# EAGLE board Lattepanda_shild_v1.2 (EAGLE 6.5.0)
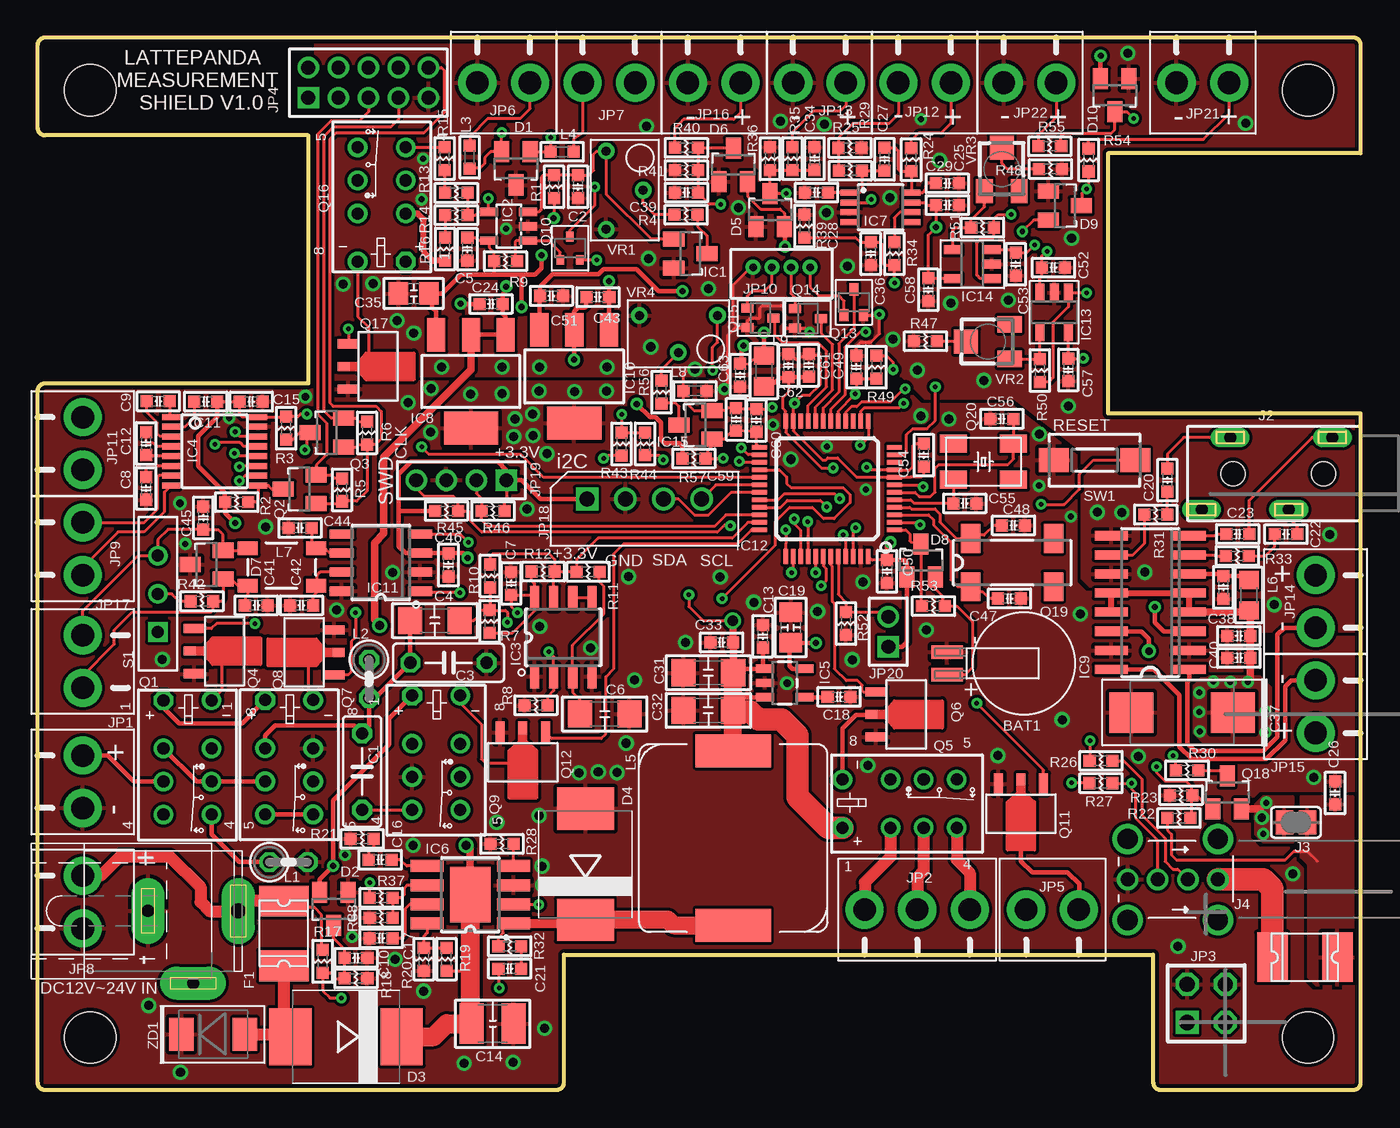
[diagram p1: board, top side]
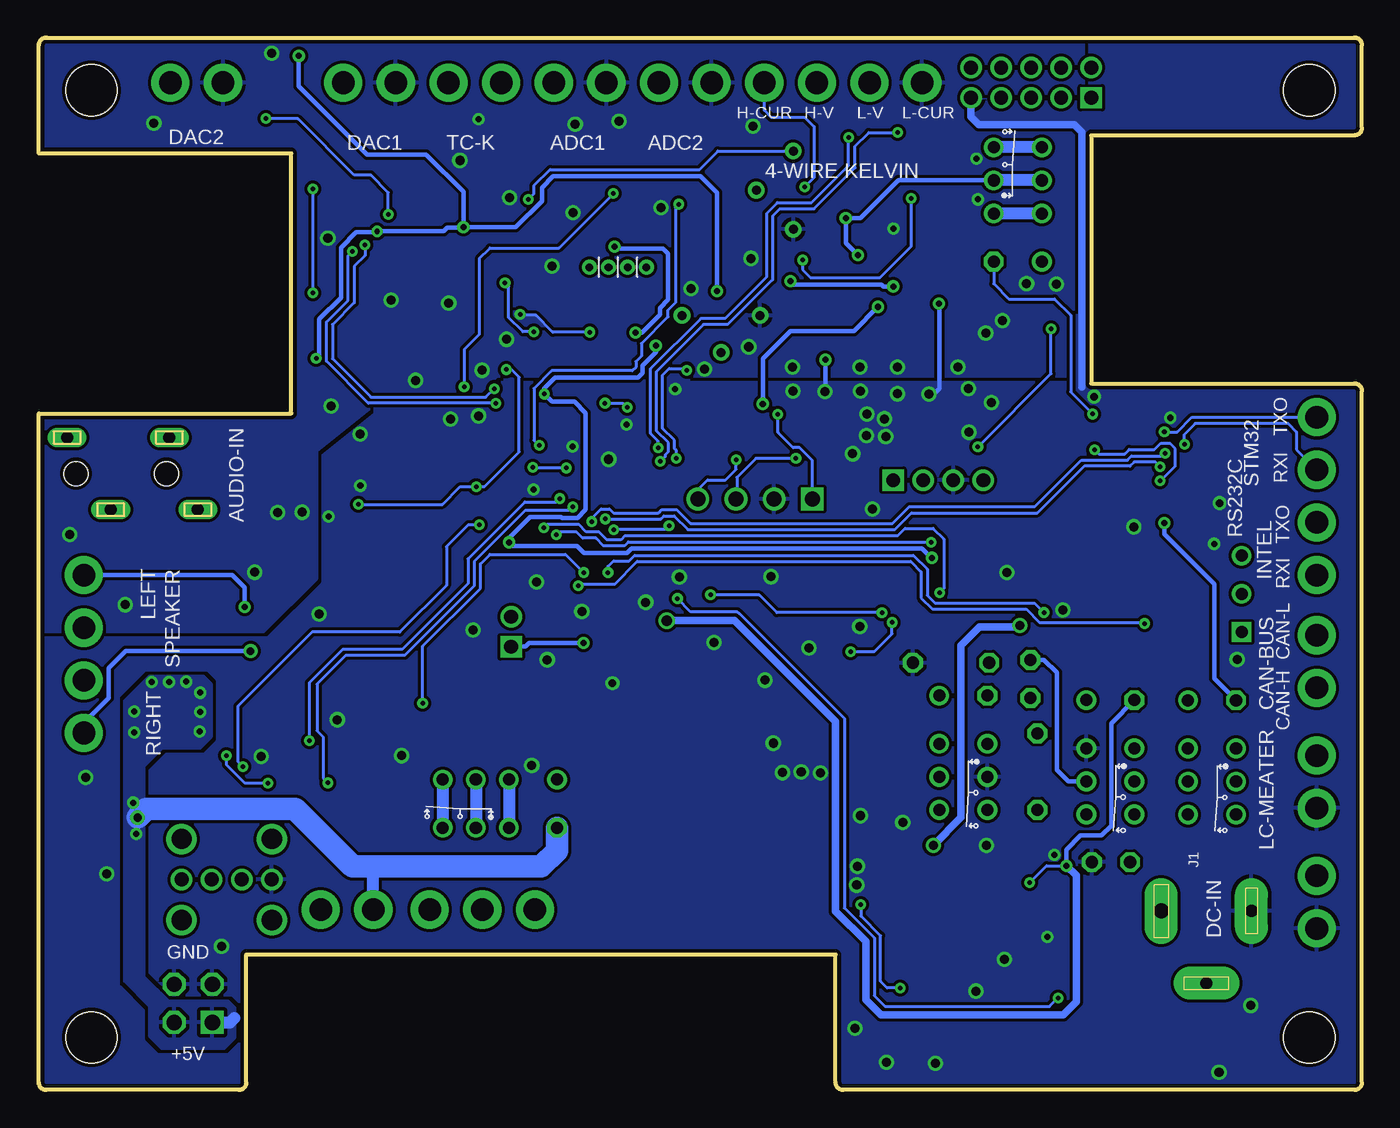
[diagram p2: board, bottom side, seen from below]

Size 88 x 70 mm. Coordinates in mm from the lower left corner, seen from the top.
Outline: 87.5,70 0.5,70 arc90 0,69.5 0,64 arc90 0.5,63.5 18,63.5 18,47 0.5,47 arc90 0,46.5 0,0.5 arc90 0.5,0 34.5,0 arc90 35,0.5 35,9 74.2,9 74.2,0.5 arc90 74.7,0 87.5,0 arc90 88,0.5 88,45 71.2,45 71.2,62.3 88,62.3 88,69.5 arc90 87.5,70
Copper layers (1*16): Top 0.035mm / dielectric 1.5mm / Bottom 0.035mm
Design rules "KHC_mm": minimum track width 0.2mm, minimum drill 0.3mm, track to track 0.2mm, track to pad 0.2mm, pad to pad 0.2mm, via to via 0.2mm, smd to smd 0.2mm, copper to edge 10mil, drill to drill 0.2mm, minimum pad ring 10mil, minimum via ring 8mil, stop-mask expansion 4mil, vias tented up to drill 0mil, thermal gap 10mil
Net classes: 0 default: clearance 0.2 mm; 1 power: width 0.152 mm; 2 GND: width 0.152 mm, clearance 0.152 mm
Holes 3.4 mm at 3.5,66.5 84.5,66.5 3.5,3.5 84.5,3.5

## Footprints (pad centres in the part's own frame; a part is rotated, then mirrored left to right if it is on the bottom)
MS621 = smd 2.1 x 0.9: + 5.1,0.75; - 5.1,-0.75
C050-025X075 = drill 0.813 octagon: 1 -2.54,0; 2 2.54,0
C0603 = smd 0.8 x 0.8: 1 -0.762,0; 2 0.762,0
C3216 = smd 1.6 x 1.8: 1 -1.651,0; 2 1.651,0
C3225 = smd 1.6 x 2.7: 1 -1.397,0; 2 1.397,0
C2012 = smd 1.3 x 1.5: 1 -1.016,0; 2 1.016,0
C1608- = smd 0.8 x 0.8: 1 -0.762,0; 2 0.762,0
D/7343-31W = smd 2.95 x 2.7: + 3.375,0; - -3.375,0
SOT23 = smd 1 x 1.4: D 0,-1.1; G 0.95,1.1; S -0.95,1.1
SMC = smd 2.8 x 3.8: A 3.7,0; C -3.7,0
1812L = smd 2.03 x 3.3: P$1 -2.16,0; P$2 2.16,0
SOT23-5L = smd 0.55 x 1.2: 1 -0.95,-1.3; 2 0,-1.3; 3 0.95,-1.3; 4 0.95,1.3; 5 -0.95,1.3
SO8 = smd 0.6 x 1.6: 1 -1.905,-2.6; 2 -0.635,-2.6; 3 0.635,-2.6; 4 1.905,-2.6; 5 1.905,2.6; 6 0.635,2.6; 7 -0.635,2.6; 8 -1.905,2.6
PW_R-PDSO-G16 = smd 0.4 x 1.2: 1 -2.275,-2.9; 2 -1.625,-2.9; 3 -0.975,-2.9; 4 -0.325,-2.9; 5 0.325,-2.9; 6 0.975,-2.9; 7 1.625,-2.9; 8 2.275,-2.9; 9 2.275,2.9; 10 1.625,2.9; 11 0.975,2.9; 12 0.325,2.9; 13 -0.325,2.9; 14 -0.975,2.9; 15 -1.625,2.9; 16 -2.275,2.9
SOT23-5 = smd 0.55 x 1.2: 1 -0.95,-1.3; 2 0,-1.3; 3 0.95,-1.3; 4 0.95,1.3; 5 -0.95,1.3
S08-EP1 = smd 0.8 x 2.2: 1 -1.905,-2.87; 2 -0.635,-2.87; 3 0.635,-2.87; 4 1.905,-2.87; 5 1.905,2.87; 6 0.635,2.87; 7 -0.635,2.87; 8 -1.905,2.87 | smd 3.7 x 2.71: EX_PAD 0,0
MSOP8 = smd 0.4 x 1.2: 1 -0.975,-2.05; 2 -0.325,-2.05; 3 0.325,-2.05; 4 0.975,-2.05; 5 0.975,2.05; 6 0.325,2.05; 7 -0.325,2.05; 8 -0.975,2.05
SOT223-4 = smd 1.2 x 2.2: 1 -2.311,-3.1; 2 0,-3.1; 3 2.311,-3.1 | smd 3.6 x 2.2: 4 0,3.1
SOIC16N = smd 0.6 x 2.2: 1 -4.445,-2.6; 2 -3.175,-2.6; 3 -1.905,-2.6; 4 -0.635,-2.6; 5 0.635,-2.6; 6 1.905,-2.6; 7 3.175,-2.6; 8 4.445,-2.6; 9 4.445,2.6; 10 3.175,2.6; 11 1.905,2.6; 12 0.635,2.6; 13 -0.635,2.6; 14 -1.905,2.6; 15 -3.175,2.6; 16 -4.445,2.6
SOT223 = smd 1.219 x 2.235: 1 -2.311,-3.099; 2 0,-3.099; 3 2.311,-3.099 | smd 3.6 x 2.2: 4 0,3.099
TQFP48 = smd 0.3 x 1: 1 -2.75,-4.5; 2 -2.25,-4.5; 3 -1.75,-4.5; 4 -1.25,-4.5; 5 -0.75,-4.5; 6 -0.25,-4.5; 7 0.25,-4.5; 8 0.75,-4.5; 9 1.25,-4.5; 10 1.75,-4.5; 11 2.25,-4.5; 12 2.75,-4.5; 25 2.75,4.5; 26 2.25,4.5; 27 1.75,4.5; 28 1.25,4.5; 29 0.75,4.5; 30 0.25,4.5; 31 -0.25,4.5; 32 -0.75,4.5; 33 -1.25,4.5; 34 -1.75,4.5; 35 -2.25,4.5; 36 -2.75,4.5 | smd 1 x 0.3: 13 4.5,-2.75; 14 4.5,-2.25; 15 4.5,-1.75; 16 4.5,-1.25; 17 4.5,-0.75; 18 4.5,-0.25; 19 4.5,0.25; 20 4.5,0.75; 21 4.5,1.25; 22 4.5,1.75; 23 4.5,2.25; 24 4.5,2.75; 37 -4.5,2.75; 38 -4.5,2.25; 39 -4.5,1.75; 40 -4.5,1.25; 41 -4.5,0.75; 42 -4.5,0.25; 43 -4.5,-0.25; 44 -4.5,-0.75; 45 -4.5,-1.25; 46 -4.5,-1.75; 47 -4.5,-2.25; 48 -4.5,-2.75
SOT23-5' = smd 0.6 x 1.2: 1 -0.95,-1.306; 2 0,-1.306; 3 0.95,-1.306; 4 0.95,1.306; 5 -0.95,1.306
SPC4077 = drill 0.8 pad 2.184 long: 1 -3,0; 2 0,-4.8 | drill 1 pad 2.184 long: 3 3,0
PJ-327-2 = drill 0.8 long: 1 -2.4,-1.9; 2 2.4,-4.8; 3 -2.4,-8.7; 4 2.4,-10.6 | hole 1.6: 0,-2.5; 0,-8.5
SJ = smd 1.168 x 1.6: 1 -0.762,0; 2 0.762,0
USB_AF_SIDE = drill 0.92: 1 3,0; 2 1,0; 3 -1,0; 4 -3,0 | drill 1.35: SH1 -3,2.7; SH2 3,2.7; SH3 -3,-2.7; SH4 3,-2.7
ED350V-02P = drill 1.5 pad 2.54: 1 -1.75,0; 2 1.75,0
ED350V-03P = drill 1.5 pad 2.54: 1 -3.5,0; 2 0,0; 3 3.5,0
2X02 = drill 1.016 square: 1 -1.27,-1.27 | drill 1.016 octagon: 2 -1.27,1.27; 3 1.27,-1.27; 4 1.27,1.27
2X05M = drill 0.914 square: 1 -4,-1 | drill 0.914: 2 -4,1; 3 -2,-1; 4 -2,1; 5 0,-1; 6 0,1; 7 2,-1; 8 2,1; 9 4,-1; 10 4,1
53047-04 = drill 0.5 pad 0.95: 1 -1.895,0; 2 -0.645,0; 3 0.625,0; 4 1.895,0
MOLEX5267-04 = drill 1 square: 1 -3.81,0 | drill 1: 2 -1.27,0; 3 1.27,0; 4 3.81,0
1X04M = drill 0.914 square: 1 -3,0 | drill 0.914: 2 -1,0; 3 1,0; 4 3,0
1X02M = drill 0.914 square: 1 -1,0 | drill 0.914: 2 1,0
0207/2V = drill 0.813 octagon: 1 -1.27,0; 2 1.27,0
L0603 = smd 0.8 x 0.8: 1 -0.762,0; 2 0.762,0
SHP1260P-F = smd 2.2 x 5: 1 -5.8,0; 2 5.8,0
L0805 = smd 1.2 x 1.3: 1 -1.016,0; 2 1.016,0
ACT45B = smd 1.35 x 0.9: 1 -2.275,1.25; 2 -2.275,-1.25; 3 2.275,-1.25; 4 2.275,1.25
ANG200X = drill 0.8 octagon: 1 -4.3,-1.6 | drill 0.8: 2 -1.1,-1.6; 3 1.1,-1.6; 4 3.3,-1.6; 5 3.3,1.6; 6 1.1,1.6; 7 -1.1,1.6; 8 -4.3,1.6
MPT3 = smd 0.6 x 1.4: BASE -1.5,-2; EMITTER 1.5,-2 | smd 0.6 x 0.8: COLLECTOR 0,-2.3
SOT323 = smd 0.5 x 0.65: 1 0.65,-0.775; 2 -0.65,-0.775; 3 0,0.775
SC59-BEC = smd 0.6 x 0.8: 1 0.65,-0.863; 2 -0.65,-0.863; 3 0,0.863
MC-306 = smd 1.3 x 1.9: 1 -2.75,-1.6; 2 2.75,-1.6; 3 2.75,1.6; 4 -2.75,1.6
SMD5032 = smd 1.8 x 1.2: 1 -2,-1.2; 2 2,-1.2; 3 2,1.2; 4 -2,1.2
R0603 = smd 0.8 x 0.8: 1 -0.762,0; 2 0.762,0
R0603@1 = smd 0.8 x 0.8: 1 -0.762,0; 2 0.762,0
255SB = drill 0.8 square: 1 -2.54,0 | drill 0.8: 2 0,0; 3 2.54,0
DTSM-3 = smd 2 x 1.6: 1 -2.7,0; 2 2.7,0
3266W = drill 0.6: 1 -2.6,-1.23; 2 0,1.23; 3 2.6,-1.23
R-TRIMMER-3313J = smd 1.1 x 1.6: 1 -1.15,-1.45; 3 1.15,-1.45 | smd 1.6 x 1.6: 2 0,1.45
SMB = smd 1.62 x 2.18: A 2.11,0; C -2.11,0

## Placement (x,y rotation side)
BAT1  MS621  [MS621]  65.59,28.37 180 top
C1  1000pF/1%  [C050-025X075]  21.58,21.18 270 top
C2  0.1uF  [C0603]  35.94,60.08 90 top
C3  1000pF/1%  [C050-025X075]  27.33,28.42 0 top
C4  10uF/16V  [C3216]  26.42,31.22 180 top
C5  0.1uF  [C0603]  28.58,55.92 270 top
C6  10uF/16V  [C3216]  37.72,25.01 0 top
C7  0.1uF  [C0603]  31.5,33.7 90 top
C8  0.1uF  [C0603]  7.22,40.02 90 top
C9  0.1uF  [C0603]  8.03,45.81 0 top
C10  10nF  [C0603]  21.17,8.78 0 top
C11  0.1uF  [C0603]  11.19,45.79 180 top
C12  0.1uF  [C0603]  7.22,43.01 90 top
C13  1uF/10V  [C0603]  48.23,30.18 270 top
C14  10uF/35V  [C3225]  30.27,4.41 0 top
C15  0.1uF  [C0603]  14.21,45.79 180 top
C16  2.2nF/50V  [C0603]  22.79,15.32 180 top
C17  0.1uF/50V  [C0603]  22.86,10.1 180 top
C18  470pF  [C0603]  53.31,26.15 180 top
C19  4.7uF  [C2012]  50.09,30.76 90 top
C20  0.22uF  [C0603]  75.14,40.57 90 top
C21  10nF/50V  [C0603]  31.41,8.07 180 top
C22  0.22uF  [C0603]  83.03,36.97 0 top
C23  1uF  [C0603]  79.82,36.98 0 top
C24  0.1uF/50V  [C1608-]  30.15,52.28 0 top
C25  10nF  [C0603]  60.5,60.31 0 top
C26  0.1uF  [C0603]  86.29,19.76 90 top
C27  0.1uF  [C0603]  56.33,61.9 270 top
C28  10nF  [C0603]  51.81,59.69 180 top
C29  10nF  [C0603]  60.51,58.86 0 top
C30  1uF  [C0603]  78.86,33.43 270 top
C31  22uF/10V  [C3216]  44.62,27.75 180 top
C32  22uF/10V  [C3216]  44.61,25.25 180 top
C33  0.1uF  [C0603]  45.5,29.77 180 top
C34  10nF  [C0603]  51.68,61.96 90 top
C35  4.7uF  [C2012]  25.01,52.98 180 top
C36  1uF  [C0603]  55.41,55.62 270 top
C37  470uF  [D/7343-31W]  76.12,25.11 0 top
C38  1uF  [C0603]  79.89,30.2 0 top
C39  10nF  [C0603]  43.15,59.69 180 top
C40  0.1uF  [C0603]  79.89,28.74 0 top
C41  47pF  [C0603]  14.55,32.24 0 top
C42  47pF  [C0603]  17.55,32.24 180 top
C43  0.1uF/50V  [C0603]  37.26,52.74 180 top
C44  47pF  [C0603]  17.45,37.39 180 top
C45  47pF  [C0603]  11.02,38.05 270 top
C46  0.1uF  [C0603]  27.32,34.92 90 top
C47  12.5pF  [C0603]  64.64,32.69 180 top
C48  12.5pF  [C0603]  64.9,37.55 180 top
C49  0.1uF  [C0603]  54.45,48.09 90 top
C50  1uF  [C0603]  56.5,34.49 270 top
C51  1uF/16V  [C0603]  34.18,52.82 180 top
C52  10nF  [C0603]  67.56,54.7 180 top
C53  10nF  [C0603]  65.06,54.93 90 top
C54  1uF  [C0603]  58.94,42.23 90 top
C55  18pF  [C0603]  61.67,39.02 180 top
C56  18pF  [C0603]  64.13,44.64 0 top
C57  100nF  [C0603]  68.55,47.9 90 top
C58  100nF  [C0603]  59.24,53.23 90 top
C59  1uF  [C0603]  46.46,44.61 90 top
C60  10nF  [C0603]  47.8,44.54 270 top
C61  1uF  [C0603]  51.29,48.2 270 top
C62  10nF  [C0603]  49.93,48.18 270 top
C63  1uF  [C0603]  46.72,47.54 90 top
D1  NPU2105  [SOT23]  31.82,61.3 0 top
D2  BAV99  [SOT23]  19.7,12.05 0 top
D3  MBRS540T3  [SMC]  20.52,3.54 180 top
D4  MBRS540T3  [SMC]  36.44,15.02 90 top
D5  BAV99  [SOT23]  48.72,58.53 180 top
D6  BAV99  [SOT23]  46.27,61.53 180 top
D7  NPU2105  [SOT23]  11.24,34.95 270 top
D8  BAT54C  [SOT23]  58.76,35.22 180 top
D9  BAV99  [SOT23]  68.31,58.82 90 top
D10  BAV99  [SOT23]  71.64,66.16 0 top
F1  1812L110/33  [1812L]  16.37,10.42 90 top
F2  FSMD300R  [1812L]  84.28,8.83 0 top
IC1  ADR512  [SOT23]  43.41,55.63 90 top
IC2  LT6202  [SOT23-5L]  31.33,57.45 90 top
IC3  LM311  [SO8]  34.96,30.11 0 top
IC4  MAX3232CPW  [PW_R-PDSO-G16]  11.78,42.49 270 top
IC5  MIC5219-3.3V  [SOT23-5]  49.69,27.07 270 top
IC6  AOZ1284PI  [S08-EP1]  28.78,12.99 90 top
IC7  AD8495  [MSOP8]  56.06,58.71 270 top
IC8  TLE4266-2G  [SOT223-4]  28.82,47.13 180 top
IC9  PAM8403  [SOIC16N]  74,32.42 90 top
IC10  LM2937IMP-10  [SOT223]  35.69,47.46 180 top
IC11  SN65HVD230  [SO8]  22.83,35.08 90 top
IC12  STM32F373X  [TQFP48]  52.5,40 90 top
IC13  LT1783  [SOT23-5']  67.61,51.73 180 top
IC14  LT1783  [SOT23-5']  62.17,54.93 90 top
IC15  ADR530  [SOT23]  43.76,44.24 270 top
J1  DC_POWER  [SPC4077]  10.34,11.91 0 top
J2  PJ-327  [PJ-327-2]  88.02,41 270 top
J3  B0  [SJ]  83.69,17.8 180 top
J4  USB A/F  [USB_AF_SIDE]  75.5,14 0 top
JP1  LC  [ED350V-02P]  3,20.5 270 top
JP2  RELAY1  [ED350V-03P]  58.5,12 0 top
JP3  Latte_5V  [2X02]  77.72,5.77 0 top
JP4  Latte_Intel  [2X05M]  22,67 0 top
JP5  LOW_SIDE_OUT  [ED350V-02P]  67.5,12 0 top
JP6  4WIR1  [ED350V-02P]  31,67 180 top
JP7  4WIR1  [ED350V-02P]  38,67 180 top
JP8  DC-IN  [ED350V-02P]  3,12.5 270 top
JP9  RS232C_LA  [ED350V-02P]  3,36 270 top
JP10  DI  [53047-04]  49.48,54.73 0 top
JP11  RS232C_STM  [ED350V-02P]  3,43 270 top
JP12  TC1  [ED350V-02P]  59,67 180 top
JP13  ADC1/COP1  [ED350V-02P]  52,67 180 top
JP14  L-SPEAKER  [ED350V-02P]  85,32.5 90 top
JP15  R-SPEAKER  [ED350V-02P]  85,25.5 90 top
JP16  ADC2/COP2  [ED350V-02P]  45,67 180 top
JP17  CAN-BUS  [ED350V-02P]  3,28.5 90 top
JP18  i2C  [MOLEX5267-04]  40.36,39.31 0 top
JP19  SWD  [1X04M]  28.18,40.56 180 top
JP20  BOOT  [1X02M]  56.58,30.48 90 top
JP21  DAC1  [ED350V-02P]  77.5,67 180 top
JP22  DAC1  [ED350V-02P]  66,67 180 top
L1  220uH/1%  [0207/2V]  16.69,15.16 0 top
L2  100uH  [0207/2V]  22.04,27.34 270 top
L3  BEAD  [L0603]  28.74,62.04 90 top
L4  BEAD  [L0603]  34.89,62.4 0 top
L5  18uH  [SHP1260P-F]  46.27,16.76 270 top
L6  BEAD  [L0805]  80.56,32.92 90 top
L7  ACT45B-510-2P-TL003  [ACT45B]  16.25,34.79 180 top
L8  BEAD  [L0603]  43.72,46.5 180 top
L9  10uH  [L0805]  48.31,47.82 270 top
Q1  AGN2004  [ANG200X]  9.97,21.62 270 top
Q2  BSS138SOT23  [SOT23]  17.44,39.97 270 top
Q3  BSS138SOT23  [SOT23]  19.24,43.73 270 top
Q4  DTDG23YP  [MPT3]  12.43,29.19 270 top
Q5  AGN2004  [ANG200X]  57.83,19.05 0 top
Q6  DTDG23YP  [MPT3]  57.77,24.98 270 top
Q7  AGN2004  [ANG200X]  16.73,21.63 270 top
Q8  DTDG23YP  [MPT3]  17.73,29.11 90 top
Q9  AGN2004  [ANG200X]  26.51,21.93 270 top
Q10  2SB1694  [SOT323]  35.41,55.99 0 top
Q11  DTDG23YP  [MPT3]  65.4,18.37 180 top
Q12  DTDG23YP  [MPT3]  32.27,21.8 180 top
Q13  DTC114EUA  [SC59-BEC]  54.29,52.39 0 top
Q14  DTC114EUA  [SC59-BEC]  51.24,51.32 270 top
Q15  DTC114EUA  [SC59-BEC]  48.07,51.35 270 top
Q16  AGN2004  [ANG200X]  22.89,59.4 90 top
Q17  DTDG23YP  [MPT3]  22.64,48.13 270 top
Q18  Si2333DS  [SOT23]  79.12,19.79 180 top
Q19  32.768k  [MC-306]  64.82,35.08 0 top
Q20  8MHz  [SMD5032]  62.91,41.79 0 top
R1  330  [R0603]  34.34,60.08 90 top
R2  10kF  [R0603]  13.24,39.1 180 top
R3  10kF  [R0603]  16.53,44.02 90 top
R4  470kF  [R0603]  43.13,58.21 180 top
R5  10kF  [R0603]  20.25,39.92 270 top
R6  10kF  [R0603]  21.91,43.7 270 top
R7  47k  [R0603]  30.06,31.17 270 top
R8  47k  [R0603]  33.15,25.59 0 top
R9  100kF  [R0603]  31.12,55.13 180 top
R10  62k  [R0603]  30.08,34.19 90 top
R11  47k  [R0603]  36.62,34.47 180 top
R12  1k  [R0603]  33.63,34.48 180 top
R13  19.1  [R0603]  27.85,59.67 180 top
R14  197  [R0603]  27.85,58.19 180 top
R15  360  [R0603]  27.07,61.95 90 top
R16  3.6k  [R0603]  27.09,55.93 270 top
R17  115kF  [R0603]  18.96,8.56 270 top
R18  10kF  [R0603]  21.17,7.42 180 top
R19  47k  [R0603]  27.19,8.7 270 top
R20  11k  [R0603]  25.69,8.7 90 top
R21  10kF  [R0603]  21.59,16.7 0 top
R22  10k  [R0603]  75.91,18.09 180 top
R23  10k  [R0603]  76.05,19.6 0 top
R24  100  [R0603]  58.1,61.88 270 top
R25  1M  [R0603]  54.03,62.66 180 top
R26  27  [R0603]  70.73,21.9 0 top
R27  27  [R0603]  70.72,20.41 0 top
R28  100k  [R0603]  30.88,16.37 180 top
R29  100  [R0603]  54.05,61.14 0 top
R30  1.5k  [R0603]  76.45,21.27 0 top
R31  1k  [R0603]  74.36,38.28 180 top
R32  0  [R0603]  31.41,9.56 180 top
R33  1k  [R0603]  79.79,35.52 180 top
R34  100k  [R0603]  56.98,55.63 270 top
R35  115kF  [R0603]  50.2,61.95 270 top
R36  10kF  [R0603]  48.71,61.94 270 top
R37  52.3kF  [R0603]  22.86,12.79 180 top
R38  10kF  [R0603]  22.86,11.45 0 top
R39  100k  [R0603]  51,57.46 270 top
R40  115kF  [R0603]  43.15,62.67 0 top
R41  10kF  [R0603]  43.15,61.18 0 top
R42  120  [R0603@1]  10.93,32.51 180 top
R43  2.2k  [R0603]  38.83,42.97 270 top
R44  2.2k  [R0603]  40.4,42.98 270 top
R45  10k  [R0603]  27.19,38.52 180 top
R46  10k  [R0603]  30.29,38.52 0 top
R47  53kF  [R0603]  59.05,49.8 0 top
R48  53kF  [R0603]  67.37,61.26 180 top
R49  10k  [R0603]  55.79,48.08 270 top
R50  30kF  [R0603]  66.66,47.86 270 top
R51  30kF  [R0603]  62.85,57.36 0 top
R52  10k  [R0603]  53.77,31.03 90 top
R53  11k  [R0603]  59.59,32.19 0 top
R54  100  [R0603]  69.9,61.86 90 top
R55  100  [R0603]  67.31,62.77 180 top
R56  470kF  [R0603]  41.49,46.41 90 top
R57  330  [R0603]  43.65,42.01 0 top
S1  CAN_TERMI  [255SB]  8,33 90 top
SW1  RESET\  [DTSM-3]  70.3,41.89 180 top
VR1  10k  [3266W]  39.05,59.85 270 top
VR2  10k  [R-TRIMMER-3313J]  63.2,49.78 90 top
VR3  10k  [R-TRIMMER-3313J]  64.12,61.24 0 top
VR4  10k  [3266W]  42.62,50.29 180 top
ZD1  SM6T27CAY  [SMB]  11.68,3.7 0 top

## Tracks (layer width: path | path; a pad name or v marks a point on that pad's centre or on a via)
+1.2V_REF  (via drill 0.3)
  Top 0.2: IC2.3 33.34,58.4 33.49,58.55 33.49,60.7 33.63,60.84 R1.2 C2.2 36.65,60.84 36.98,61.17 36.98,62.25 37.17,62.44 VR1.1 37.82,59.59 40.83,56.58 IC1.G | IC7.2 55.23,59.03 v55.43,59.24
  Bottom 0.2: VR1.1 42.83,62.45 44.05,61.23 53.99,61.23 55.08,60.14 55.08,59.59 v55.43,59.24
+3V3  (via drill 0.3, 0.4)
  Top 0.2: 27.29,35.72 C46.2 | 57.82,34.26 D8.G | IC12.17 53.25,45.15 54.31,46.21 v54.38,46.29 54.45,46.46 C49.1 R49.2 | C63.2 47.3,48.29 47.59,48.58 48.05,48.58 L9.1 48.42,48.99 | D6.S 47.22,59.45 48.08,58.59 49.39,58.59 49.67,58.31 D5.S | C50.1 55.5,35.25 IC12.48 | JP19.1 31.18,39.38 31.04,39.24 31.04,38.53 R46.2 | v38.85,44.94 38.85,43.75 R43.1 R44.1
  Top 0.3: v49.71,56.1 49.71,57.39 D5.S | IC5.5 50.2,28.02 50.02,28.2 50.02,29.55 C19.1 v51.77,29.74 | v46.96,49.51 v46.96,49.5 46.8,49.34 46.8,48.32 C63.2 | v56.73,36.43 56.5,36.2 C50.1 57.64,35.25 57.81,35.08 D8.G 57.81,29.81 57.48,29.48 JP20.1 | JP18.1 33.45,39.31 32.19,40.57 JP19.1 31.17,41.23 30.61,41.79 24.84,41.79 24.01,40.96 24.01,38.5 | 24.01,38.5 24.01,36.16 24.46,35.71 IC11.3 27.29,35.72 28.3,35.72 v28.61,35.4 | R45.2 24.03,38.52 24.01,38.5 | L9.1 v48.31,50.37 v48.32,50.38
  Bottom 0.2: JP18.1 36.55,41.88 37.4,42.73 37.83,42.73 R43.1 38.83,44.92 v38.85,44.94
  Bottom 0.3: v51.77,29.74 55.38,29.74 55.63,29.49 JP20.1 | v28.61,35.4 28.64,35.39 29.26,36.01 48.58,36.01 48.88,35.71 51.72,35.71 52.19,36.18 56.48,36.18 v56.73,36.43 56.73,36.71 55.32,38.12 53.25,38.12 53.18,38.05 52.18,38.05 51.63,38.6 51.63,45.03 52.38,45.78 53.87,45.78 v54.38,46.29 54.38,46.67 53.67,47.38 48.16,47.38 47.84,47.7 47.84,48.2 46.96,49.08 v46.96,49.51 | v49.71,56.1 49.58,55.97 46.49,55.97 46.14,55.62 46.14,52.56 46.68,52.02 46.68,51.58 47.88,50.38 v48.32,50.38
+5V  (via drill 0.3, 0.4, 0.54, 0.7)
  Top 0.2: C11.1 C15.2 13.44,44.92 13.59,44.77 IC4.16 16.51,44.77 R3.2 17.31,44.78 17.49,44.96 v17.9,44.96 | R37.2 v22.09,13.78 v22.1,13.79 | 32.72,34.47 R12.2 32.85,34.46 32.85,33.87 33.05,33.66 IC3.8 | IC3.8 | C33.1 | v31.92,31.75 31.5,32.17 C7.1 32.83,32.94 IC3.8 | v43.32,32.95 43.32,32.16 44.26,31.22 v46.24,31.22 | R7.2 31.59,30.41 33.05,31.88 IC3.8
  Top 0.3: 80.27,31.61 L6.1 | Q1.1 8.37,25.45 9.43,24.39 13.59,24.39 Q7.1 | D2.S 18.75,14.02 v19.65,14.92 19.67,14.94 19.67,19.25 23.39,22.97 23.39,24.71 Q9.1 | 81.31,18.69 v81.73,19.11 | IC5.3 46.49,26.12 46.26,26.35 | C31.1 46.53,28.02 IC5.1 48.23,28.18 C13.2 | C11.1 11.95,44.77 10.69,43.51 10.69,41.5 12.44,39.75 12.44,39.14 R2.2 12.48,38.38 v13.14,37.72
  Top 0.4: IC9.4 IC9.5 IC9.12 IC9.13
  Top 0.5: C33.1 C31.1 | C33.1 46.26,31.2 v46.24,31.22 | IC9.4 80.44,31.79 L6.1 80.65,31.81 C38.2 C40.2 80.65,27.3 v80.49,27.14 | 81.31,18.69 Q18.S
  Top 1.2: L5.1 C32.1 46.26,26.35 C31.1
  Top 1.5: Q5.1 52.59,17.45 50.53,19.51 50.53,23.57 49.46,24.64 47.94,24.64 47.39,25.19 46.32,25.19 C32.1
  Bottom 0.2: Q16.1 24.49,53.62 23.48,52.61 20.44,52.61 19.37,51.54 19.37,46.43 v17.9,44.96 | v22.1,13.79 20.98,14.91 v19.66,14.91 v19.65,14.92 | 65.75,14.62 66.25,14.62 66.5,14.87 | v31.92,31.75 38.91,31.75 40.08,32.92 43.29,32.92 v43.32,32.95
  Bottom 0.3: v19.65,14.92 19.65,15.98 18.71,16.92 17.33,16.92 16.67,17.58 16.67,24.39 Q7.1 | v13.14,37.72 13.15,36.98 9.82,33.65 9.82,27.37 Q1.1
  Bottom 0.5: v46.24,31.22 41.72,31.22 35,24.5 35,11.89 33,9.89 33,6 32,5 19.87,5 19,5.87 19,14.27 v19.65,14.92
  Bottom 0.8: JP3.1 75.28,4.5 74.99,4.78 | JP5.1 65.75,14.62 65.5,14.87
  Bottom 1.5: Q5.1 53.53,15.92 54.58,14.87 66.5,14.87 67.11,14.87 70.6,18.36 70.61,18.36 70.95,18.7 80.85,18.7 v81.43,18.12
  other vias: 79.34,27.14 78.2,27.16 77.3,23.84 77.26,26.43 77.27,25.14 81.66,25.17 81.66,23.79 81.52,17.03
  pour Top: 77.5,27.5 81.29,27.5 81.99,26.8 81.99,23.64 81.31,22.96 77.69,22.96 76.89,23.76 76.89,26.89
  pour Bottom: 77,27.5 80.69,27.5 82.32,25.87 82.32,7.25 80.64,5.57 80.64,3.58 79.85,2.79 75.64,2.79 74.94,3.49 74.94,5.47 75.36,5.89 79.34,5.89 80.99,7.54 80.99,21.54 79.77,22.76 77.24,22.76 76.5,23.5 76.5,27
  pour Top: 83,19.5 81.5,19.5 81,19 81,17 81.5,16.5 83.5,16.5 83.5,19.5
+5V/1  (via drill 0.4)
  Top 0.2: R1.1 34.34,58.4 v34.33,57.99 | R57.1 42.95,42 | C5.1 28.59,56.67 29.12,56.67 29.29,56.5 IC2.5 30.03,56.03 30.31,55.75 30.31,55.18 R9.2 30.36,54.38 30.5,54.24
  Top 0.3: 32.16,54.24 30.5,54.24 28.16,54.24 26.9,52.98 C35.1 26.24,53 26.24,52.05 26.49,51.8 26.49,50.48 IC8.3 | 32.16,54.24 33.1,54.24 33.52,54.66 v33.52,55.53 | v39.85,45.64 40.73,44.76 41.1,44.76 41.46,44.4 41.46,43.25 41.67,43.04 42.65,43.04 42.89,42.8 R57.1 | v32.19,52.09 32.19,54.21 32.16,54.24
  Bottom 0.2: 34.31,57.97 v34.33,57.99
  Bottom 0.3: Q16.3 30.82,60.5 33.34,57.98 v34.32,57.98 v34.33,57.99 | 34.31,57.97 34.31,56.32 v33.52,55.53 | v39.85,45.64 39.85,48.66 38.02,50.49 33.79,50.49 v32.19,52.09
  Bottom 0.8: Q16.6 Q16.3
+10V  (via drill 0.3, 0.34, 0.4)
  Top 0.2: IC7.7 58.98,59.03 59.16,58.86 C29.1 | 59.73,58.84 59.73,57.42 v59.76,57.39 59.24,56.87 C58.2 59.25,53.98 IC14.5 | IC13.5 C57.2 v69.55,48.66 | D9.S 66.26,57.87 v65.5,57.11
  Top 0.3: 59.73,58.84 C29.1 | D10.S v70.69,68.77 v70.7,68.78 | 33.26,52.64 C51.2 | v42.9,53.13 41.29,53.13 39.82,54.6 37.64,54.6 37.32,54.28 34.25,54.28 33.42,53.45 C51.2 | IC10.3 33.38,52.78 C51.2
  Bottom 0.2: 59.78,57.37 v59.76,57.39 | 65.55,57.06 v65.5,57.11
  Bottom 0.3: v70.7,68.78 70.7,66.75 66.17,62.22 62.23,62.22 59.75,59.74 v59.75,57.4 v59.76,57.39 56.28,57.39 54.54,59.13 54.54,60.01 53.78,60.77 43.98,60.77 42.9,59.69 v42.9,53.13 | 59.78,57.37 60.83,57.37 61.09,57.11 v65.5,57.11 | 65.55,57.06 66.88,57.06 67.9,56.04 67.9,52.71 69.34,51.27 69.34,48.87 v69.55,48.66
+UB
  Top 0.2: 85.12,15.21 85.1,15.23 84.45,15.88 83.55,15.88 82.99,15.32 75.72,15.32 75.41,15.63 75.41,17.01 75.15,17.27 R22.2
  pour Top: 84,19.5 84,15.5 84.5,15 84.5,7.5 85,7 87.5,7 87.5,19.5
AGND  (via drill 0.3, 0.4, 0.6)
  Top 0.2: 46.52,45.39 C59.2 | C59.2 45.92,45.37 45.74,45.19 IC15.S 43.66,45.19 42.96,45.89 L8.2 42.96,47.63 43.33,48 | C54.1 58.94,40.92 58.81,40.79 58.08,40.79 58.06,40.77 58.05,40.77 58.03,40.75 IC12.8 54.49,40.75 53.2,42.04 52.56,42.04 52.42,41.9 52.2,41.9 50.26,43.84 IC12.23 50.25,45.48 50.34,45.57 v50.34,45.69 50.87,46.22 51.35,46.22 52.06,46.93 52.06,48.74 51.95,48.85 51.4,48.85 C61.1 51.28,48.79 50.72,48.79 50.5,48.57 C62.1 | v48.85,45.39 v48.86,45.4 48.76,45.3 C60.1 46.53,45.3 C59.2
  Bottom 0.2: 48.88,45.4 v48.86,45.4 49.15,45.69 v50.34,45.69
  other vias: 23.92,51.18 33.38,48.09 26.88,48.09 30.88,48.09 37.88,48.09 56.68,59.35 53.86,54.8 70.48,38.43 72.11,38.42 73.65,34.44 85.93,36.94 82.25,32.28 68.55,45.49 56.88,49.93 59.99,61.83 68.77,56.66 60.73,52.35 64.56,52.53 72.52,68.95 52.46,58.35 46.62,58.69 40.62,55.31 22.3,53.63 31.15,57.29 20.32,53.6 25.55,59.24 25.63,61.94 40.51,64.11 49.4,64.43 58.75,64.58 52.32,64.23 58.51,47.87 62.94,47.2 80.34,64.3 44.62,53.31 43.73,47.94 25.02,50.35 40.78,49.43
  pour Top (rank 2): 18.5,70 88,70 88,62.5 71,62.5 71,45 88,45 88,30.5 73,30.5 69.5,34 69.5,42.5 65,46 59,46 57.5,47.5 18.5,47.5
  pour Bottom (rank 2): 18.5,70 88,70 88,62.5 71,62.5 71,45 88,45 88,30.5 73,30.5 69.5,34 69.5,42.5 64.5,46.5 58.5,46.5 57.5,47.5 18.5,47.5
BOOT1
  Top 0.2: IC12.44 53.25,32.96 53.77,32.44 R52.2 56.27,31.79 JP20.2
CAN_RX  (via drill 0.3)
  Top 0.2: IC12.45 53.75,36.75 v53.57,36.93 | IC11.4 28.11,36.98 v28.65,36.44
  Bottom 0.2: v28.65,36.44 28.67,36.46 48.78,36.46 49.05,36.19 50.44,36.19 50.95,36.7 51.82,36.7 52.23,37.11 53.39,37.11 v53.57,36.93
CAN_TX  (via drill 0.3)
  Top 0.2: v28.09,33.08 25.52,33.08 IC11.1 | IC12.46 54.25,37.24 v54.41,37.4
  Bottom 0.2: 54.41,37.42 v54.41,37.4 54.21,37.6 52.06,37.6 51.59,37.13 50.75,37.13 50.21,36.59 49.28,36.59 49,36.87 30.87,36.87 30.39,37.35 28.52,37.35 27.81,36.64 27.81,33.36 v28.09,33.08 27.92,33.25
CANH
  Top 0.2: JP17.1 3,27.55 5.11,29.66 5.11,30.59 6.3,31.78 11.53,31.78 11.69,31.94 R42.1 12.22,32.51 12.34,32.63 D7.G 12.86,34 13.26,33.6 13.91,33.6 L7.4 13.98,32.98 13.79,32.79 C41.1
CANL
  Top 0.2: JP17.2 3,31.86 6.68,35.54 S1.3 8,36.61 8.68,37.29 C45.2 11.06,37.25 12.03,37.25 12.34,36.94 D7.S 13.84,35.9 L7.3
COMP1_P  (via drill 0.3)
  Top 0.2: C34.1 51.67,61.19 R35.2 50.19,61.18 R36.2 48.72,61.17 D5.D v49.78,59.63 | IC12.11 57.66,42.25 57.8,42.39 57.8,43.58 58.21,43.99 59.16,43.99 59.71,44.54 v59.71,46.77
  Bottom 0.2: v49.78,59.63 53.41,56 58,56 58.71,55.29 58.71,50.25 59.7,49.26 v59.7,46.78 v59.71,46.77
COMP2_P  (via drill 0.3)
  Top 0.2: D6.D 46.23,62.67 R40.2 R41.2 C39.1 44.68,58.92 v45.44,58.92 | IC12.13 55.25,43.4 v54.72,42.87
  Bottom 0.2: v45.44,58.92 45.66,58.7 45.66,52.36 46.14,51.88 46.14,51.44 47.92,49.66 47.92,48.82 48.29,48.45 48.29,48.08 48.53,47.84 53.89,47.84 55.06,46.67 55.06,43.21 v54.72,42.87 | 54.92,43.07 v54.72,42.87 | 55.01,43.16 v54.72,42.87
D+  (via drill 0.3)
  Top 0.2: J4.3 74.5,16.62 73.02,18.1 73.02,19.76 72.75,20.03 v72.75,20.41 R27.2 | R30.1 75.69,22.07 v75.52,22.24
  Bottom 0.2: v72.75,20.41 74.28,20.41 75.52,21.65 v75.52,22.24
D-
  Top 0.2: J4.2 75.82,14.68 75.51,14.68 74.99,15.2 74.99,16.75 73.43,18.31 73.43,20.7 72.23,21.9 R26.2
DAC1_OUT1  (via drill 0.3)
  Top 0.2: IC12.14 54.75,45.15 54.98,45.38 57.31,45.38 v57.61,45.68 | IC13.3 66.66,53.96 66.8,54.1 C52.2 66.77,54.73 66.77,55.47 67.09,55.79 v67.14,55.79
  Bottom 0.2: v67.14,55.79 67.44,55.49 67.44,52.52 68.87,51.09 68.87,48.47 66.08,45.68 v57.61,45.68
DAC2_OUT1  (via drill 0.3)
  Top 0.2: IC12.16 53.75,45.08 54.12,45.45 54.48,45.45 54.82,45.79 56.75,45.79 57.61,46.65 v57.7,46.65 57.64,46.65 | IC14.3 64.99,55.88 C53.2 65.79,55.69 v66.3,56.2
  Bottom 0.2: v66.3,56.2 66.3,55.51 67.02,54.79 67.02,52.36 68.46,50.92 68.46,48.64 65.9,46.08 58.27,46.08 v57.7,46.65
DC-IN
  Top 0.8: F1.P$1 16.37,4.11 D3.A 16.79,3.7 ZD1.A
DC_IN_ADC  (via drill 0.3)
  Top 0.2: D2.D 19.7,10.08 20.41,9.37 C10.1 R18.2 20.38,7.39 19.86,7.39 19.45,7.8 R17.2 18.96,6.61 19.45,6.12 v20.21,6.12 | IC12.28 49.34,41.25 49.81,40.78 49.81,40.35 49.82,40.35 50.11,40.06 53.57,40.06 54.03,39.6 54.03,39.06 52.97,38 52.28,38 51.53,38.75 50.01,38.75 49.05,37.79 49.05,36.22 v45.52,32.69
  Bottom 0.2: v20.21,6.12 20.77,5.56 31.71,5.56 32.43,6.28 32.43,10.11 34.42,12.1 34.43,12.1 34.43,24.72 41.4,31.69 41.41,31.69 41.53,31.81 44.64,31.81 v45.52,32.69
DI_CH1
  Top 0.2: IC12.19 52.25,45.37 53.29,46.41 53.29,49.64 54.29,50.64 Q13.3
DI_CH2
  Top 0.2: IC12.20 51.75,45.44 52.88,46.57 52.88,49.58 52.1,50.36 Q14.3
DI_CH3
  Top 0.2: IC12.21 51.25,45.54 52.48,46.77 52.48,49.14 51.93,49.69 49.57,49.69 49.05,50.21 49.05,51.32 48.98,51.39 Q15.3
GND  (via drill 0.3, 0.4, 0.5, 0.6)
  Top 0.2: JP10.1 47.46,54.73 46.22,53.49 46.22,51.1 46.62,50.7 Q15.1 | Q15.1 46.41,50.7 45.89,50.18 45.89,46.84 v45.67,46.62 | v51.35,50.41 51.09,50.67 Q14.1 49.82,50.67 49.65,50.84 49.65,51.99 49.46,52.18 48.25,52.18 48.06,51.99 48.06,51.38 48.01,51.33 47.39,51.33 47.21,51.15 Q15.1 | Q13.1 55.92,51.53 v55.98,51.59 v55.99,51.59 55.99,50.3 55.44,49.75 54.74,49.75 54.45,49.46 C49.2
  Top 0.3: C43.2 36.49,52.11 36.42,52.04 35.94,52.04 35.69,51.79 IC10.2 v35.69,48.57 | C24.1 28.15,52.28 v28.13,52.3
  Bottom 0.2: v51.35,50.41 53.82,50.41 Q13.1 55.92,51.53 v55.98,51.59
  Bottom 0.3: v35.69,48.57 35.69,46.59 35.68,46.58 | 28.56,46.19 28.11,46.64 28.11,52.28 v28.13,52.3
  Bottom 0.5: JP4.9 26,64.73 25.46,64.19 19.11,64.19 18.64,63.72 18.64,46.78 18.61,46.75
  other vias: 17.81,46.12 9.47,39.04 84.88,20.8 54.88,33.8 66.62,43.62 31.75,44.64 73.2,22.19 33.4,30.83 60.62,44.62 24.64,45.73 36.02,21.1 58.76,44.84 52.5,42.81 48.9,44.25 55.1,39.93 69.35,31.67 68.72,38.15 66.61,40.19 75.85,9.55 83.47,14.38 63.86,22.24 55.21,21.59 49.84,27.07 59.11,30.59 54.18,28.62 51.88,31.83 47.63,32.44 68.14,24.63 38.54,21.11 37.29,21.17 33.71,4.1 31.63,1.85 7.39,5.62 9.5,1.17 20.92,10.2 20.46,15.63 23.78,8.69 9.83,36.33 12.73,44.71 15.16,37.46 23.62,34.41 19.9,31.94 36.78,29.41 45.4,34.12 39.3,34.14 32.56,38.64 8.3,28.63 24.98,16.27 25.67,6.58 33.6,13.63 30.54,17.81 33.34,18.25 28.37,1.77 39.71,27.26 43.08,29.77 39.15,23.07 50.09,41.95 26.14,43.75 31.67,43.47 33.87,42.32 30.89,46.31 28.8,46.28 26.17,46.66 35.7,46.46 37.85,46.48 33.36,46.48 32.92,44.96 32.96,43.54 33.54,14.89
  pour Bottom (rank 3): 0,70 88,70 88,62.3 71.2,62.3 71.2,45 88,45 88,0 74.2,0 74.2,9 35,9 35,0 0,0 0,47 18,47 18,63.5 0,63.5
  pour Top (rank 3): 0,70 88,70 88,62.3 71.2,62.3 71.2,45 88,45 88,0 74.2,0 74.2,9 35,9 35,0 0,0 0,47 18,47 18,63.5 0,63.5
KELVIN_M  (via drill 0.3)
  Top 0.2: L3.1 28.83,61.32 29.44,61.32 29.74,61.62 29.74,62 30.14,62.4 D1.S v30.87,63.68 v30.88,63.69 | IC12.27 46.72,41.75 v46.66,41.81
  Bottom 0.2: v46.66,41.81 46.34,42.13 46.34,42.24 46.13,42.45 46.13,43.06 46.91,43.84 46.91,47.8 43.79,50.92 42.18,50.92 39.2,53.9 39.2,58.13 38.71,58.62 36.43,58.62 33.71,61.34 33.71,62.78 32.8,63.69 v30.88,63.69
KELVIN_P  (via drill 0.3)
  Top 0.2: D1.G L4.1 v34.13,63.36 | IC12.26 47.26,42.25 v46.8,42.71
  Bottom 0.2: v34.14,63.37 v34.13,63.36 v34.14,63.35 34.14,61.49 36.6,59.03 38.87,59.03 39.6,58.3 39.6,54.07 42.35,51.32 43.96,51.32 47.31,47.97 47.31,43.67 46.8,43.16 v46.8,42.71
L1  (via drill 0.3)
  Top 0.2: IC12.42 52.25,34.87 52.42,34.7 52.42,33.84 v52.11,33.53 | v14.45,31.03 11.9,31.03 11.56,30.69 Q4.BASE | Q4.BASE 10.03,30.69 9.88,30.84 10.28,30.84 Q4.BASE
  Bottom 0.2: v14.45,31.03 14.52,31.1 21.46,31.1 21.46,31.11 22.33,31.98 28.56,31.98 29.32,32.74 29.32,34.47 30.01,35.16 48.2,35.16 49.72,33.64 52,33.64 v52.11,33.53
L2  (via drill 0.3)
  Top 0.2: IC12.38 50.25,34.56 v50.14,34.42 | v21.15,31.76 21.15,30.11 20.86,29.82 20.86,27.81 20.66,27.61 Q8.BASE
  Bottom 0.2: v21.15,31.76 21.77,32.38 28.39,32.38 28.91,32.9 28.91,34.64 29.83,35.56 48.37,35.56 48.73,35.2 49.77,35.2 50.14,34.83 v50.14,34.42
L3
  Top 0.2: IC12.36 47.47,37.25 47.47,37.24 46.54,36.31 38.96,36.31 38.33,35.68 38.33,28.03 37.79,27.49 37.79,23.69 37.48,23.38 34.19,23.38 Q12.BASE
LC_PULSE
  Top 0.2: IC12.35 47.24,37.75 46.2,36.71 37.28,36.71 35.86,35.29 R11.2 | 35.82,34.51 R11.2 | 30.09,34.96 R10.2 30.08,35.48 30.28,35.68 34,35.68 34.39,35.29 R12.1 | R12.1 35.85,34.48 R11.2 | IC3.7 34.33,34.41 R12.1
LEFT
  Top 0.2: C22.2 83.79,37.49 83.22,38.06 J2.2
N$1
  Top 0.3: Q11.COLLECTOR 65.4,15.22 66.15,14.47 68.5,14.47 69.27,13.7 69.27,12.02 JP5.2
N$2
  Top 0.2: IC15.D 42.66,45.46 42.44,45.68 41.79,45.68 R56.1
N$3
  Top 0.2: R38.2 23.62,11.25 R37.1 24.18,12.79 24.36,12.97 24.36,13.42 24.57,13.62 IC6.6
N$4  (via drill 0.3)
  Top 0.2: C21.2 30.65,6.86 v30.72,6.79 | IC6.2 33.31,12.36 v33.33,12.34
  Bottom 0.2: v33.33,12.34 33.33,11.58 32.02,10.27 32.02,7.23 31.58,6.79 v30.72,6.79
N$5
  Top 0.2: IC11.6 19.43,35.72 19.15,36 18.57,36 L7.2 18.21,36.35 C44.1
N$6
  Top 0.2: IC11.7 18.8,34.45 18.55,34.19 18.55,33.56 L7.1 18.52,33.05 18.3,32.83 18.3,32.25 C42.1
N$7
  Top 0.2: R14.2 R16.1
N$8
  Top 0.2: R32.1 C21.1
N$9
  Top 0.2: R32.2 30.64,10.13 30.96,10.45 30.96,10.96 31.06,11.06 31.62,11.06 IC6.1
  Top 0.6: IC6.1 36.2,11.09 D4.C 36.46,11.34
  Top 1.2: 36.46,11.34 41.9,11.34 42.28,10.96 L5.2
N$10
  Top 0.2: IC6.5 24.55,14.89 24.12,15.32 C16.1
N$11
  Top 0.2: R21.2 22.36,16.21 22.03,15.88 C16.2
N$12
  Top 0.2: R42.2 9.42,32.51 8.93,33 S1.2
N$13
  Top 0.2: R48.2 64.49,61.26 64.12,61.63 VR3.2
N$14
  Top 0.2: IC4.5 7.24,42.16 C12.1
N$15
  Top 0.2: IC4.4 7.91,42.81 7.68,43.04 7.31,43.04 7.22,43.13 C12.2
N$16
  Top 0.2: IC4.2 9.81,44.12 10.44,44.74 10.44,45.78 C11.2
N$17
  Top 0.2: VR3.1 62.97,58.74 62.09,57.86 R51.1 61.02,57.36 60.86,57.2 IC14.4
N$18  (via drill 0.3)
  Top 0.2: R55.1 68.07,63.43 68.28,63.64 71.4,63.64 71.64,63.88 D10.D 72.46,65.06 v72.9,64.62 | v64.76,58.24 64.74,58.22 63.88,58.22 63.61,57.95 R51.2 63.61,56.74 63.5,56.63 62.75,56.63 62.46,56.34 62.46,54.2 62.68,53.98 IC14.1
  Bottom 0.2: v64.76,58.24 64.76,59.7 65.91,60.85 67.01,60.85 70.75,64.59 72.87,64.59 v72.9,64.62
N$19
  Top 0.2: IC6.8 25.91,10.45 25.69,10.23 R20.2 R19.1
N$20
  Top 0.2: L3.2 28.82,63.49 29.96,64.63 32.11,64.63 32.76,65.28 JP6.1
N$21
  Top 0.2: IC6.4 R28.1
N$22
  Top 0.2: JP7.2 36.25,63.69 35.65,63.29 L4.2
N$24
  Top 0.2: IC6.7 24.75,12.36 24.45,12.06 24.45,10.33 24.22,10.1 C17.1
N$25
  Top 0.2: IC12.1 57.75,37.25 58.01,36.99 58.01,36.53 58.09,36.45 D8.D 58.76,32.33 R53.1
N$26
  Top 0.2: IC4.6 7.34,41.52 7.22,41.39 C8.2
N$27
  Top 0.2: C9.2 8.79,44.85 IC4.1
N$28
  Top 0.2: JP9.2 3,34.76 5.36,37.12 7.08,37.12 8.45,38.49 8.45,39.78 IC4.8
N$29
  Top 0.2: IC4.3 8.16,43.47 7.97,43.66 7.97,44.38 7.27,45.08 C9.1
N$30
  Top 0.2: Q10.2 34.76,55.72 33.98,56.5 IC2.1 31.85,56.5 31.77,56.42 31.77,55.24 R9.1
N$31
  Top 0.3: Q6.COLLECTOR 55.45,24.95 54.42,24.95 53.53,24.06 Q5.8
N$32
  Top 0.2: JP9.1 7.1,37.75 7.98,38.63 7.98,40.78 8.06,40.87 IC4.7
N$33
  Top 0.2: 41.79,47.2 R56.2 41.49,47.93 VR4.2
N$34  (via drill 0.3)
  Top 0.2: IC12.7 58.79,40.25 v58.91,40.13 | R49.1 56.45,48.84 56.91,48.38 v56.91,47.92 | v66.74,38.95 68.28,38.95 69.3,39.97 69.3,40.96 70.23,41.89 SW1.1
  Bottom 0.2: v56.91,47.92 56.56,47.92 56.05,47.41 56.05,42.44 58.36,40.13 v58.91,40.13 59.97,40.13 61.15,38.95 v66.74,38.95
N$35
  Top 0.2: C56.2 64.89,43.01 Q20.3 64.91,41.98 64.53,41.6 59.94,41.6 59.68,41.34 59.68,39.77 59.37,39.46 58.64,39.46 58.35,39.75 IC12.6
N$36  (via drill 0.3)
  Top 0.2: IC4.13 13.7,42.81 13.47,43.05 11.94,43.05 v11.8,42.96
  Bottom 0.2: v11.8,42.96 11.8,43.61 11.08,44.33 4.91,44.33 4.35,43.77 4.35,42.6 JP11.2
N$37
  Top 0.2: IC3.5 IC3.6
N$38  (via drill 0.3)
  Top 0.2: 58.96,42.94 C54.2 58.35,42.99 58.21,42.85 58.21,41.46 58,41.25 IC12.9 55.29,41.25 v55.13,41.41 | 48.64,46.76 L9.2 | v52.91,41.37 52.12,41.37 49.76,43.73 IC12.24 49.75,45.15 49.57,45.33 49.57,46.05 49.93,46.41 C62.2 | 48.61,46.79 L9.2 | 48.55,47.05 L9.2 | 51.26,47.25 C61.2
  Top 0.3: 48.55,47.05 49.06,47.05 49.37,47.36 49.87,47.36 C62.2 51.27,47.42 C61.2
  Bottom 0.2: v52.91,41.37 55.09,41.37 v55.13,41.41
N$39
  Top 0.2: R11.1 37.35,34.5 37.35,33.82 37.67,33.5 37.67,31.67 35.59,29.59 IC3.3 35.59,26.45 36.04,26.01 36.04,25.04 C6.1
N$40  (via drill 0.3)
  Top 0.2: IC4.14 13.45,43.47 v13.14,43.77
  Bottom 0.2: JP11.1 11.31,44.75 12.29,43.77 v13.14,43.77
N$41
  Top 0.2: C27.2 R29.2 54.81,59.83 54.67,59.69 IC7.1 | IC7.1 | IC7.1 C28.1
N$42
  Top 0.2: C27.1 57.06,62.66 57.23,62.49 57.23,61.25 57.36,61.12 R24.2 IC7.8 58.87,59.69 59.06,59.88 59.06,60.15 59.22,60.31 C25.1
N$43
  Top 0.2: IC9.7 78.37,35.59 78.44,35.52 R33.2
N$44
  Top 0.3: IC9.1 76.6,27.26 76.45,27.11 76.45,23.06 76.97,22.54 81.51,22.54 82.46,23.49 82.46,30.3 82.9,30.74 JP14.1
N$45
  Top 0.2: R29.1 53.29,62.64 R25.2 53.27,63.33 54.22,64.28 56.61,64.28 57.25,64.92 JP12.2
N$46
  Top 0.2: R24.1 58.1,63.16 58.57,63.63 60.08,63.63 60.75,64.3 JP12.1
N$47
  Top 0.2: IC7.6 57.34,58.39 56.98,58.02 R34.1
N$48  (via drill 0.3)
  Top 0.2: C4.1 29.01,31.22 29.29,31.5 29.29,31.74 29.48,31.93 30.1,31.93 R7.1 | v34,29.16 34.33,28.84 IC3.2 34.33,26.56 33.92,26.16 R8.2 | R7.1 30.12,31.91 31.1,31.91 31.25,31.76 v31.25,31.1 | R10.1 30.08,31.95 R7.1
  Bottom 0.2: v34,29.16 32.43,29.16 31.25,30.34 v31.25,31.1
N$49  (via drill 0.3)
  Top 0.2: Q10.3 35.41,57.19 37.07,58.85 v37.07,60.06
  Bottom 0.2: JP7.1 39.75,65.16 39.29,64.7 37.06,64.7 36.44,64.08 36.44,60.69 v37.07,60.06
N$50
  Top 0.2: R35.1 50.2,63.7 51.61,65.11 53.36,65.11 53.75,65.5 JP13.1
N$51
  Top 0.2: R40.1 42.39,63.98 42.69,64.28 42.97,64.56 46.31,64.56 46.75,65 JP16.1
N$52  (via drill 0.4)
  Top 0.3: IC9.3 74.89,30.52 74.31,31.1 v74.31,32.12
  Bottom 0.3: JP14.2 75.15,34.25 74.31,33.41 v74.31,32.12
N$53  (via drill 0.5)
  Top 0.3: IC9.14 73.39,30.52 73.91,30 v73.91,29.2
  Bottom 0.3: v73.91,29.2 82.23,29.2 82.98,28.45 82.98,28.44 83.36,28.06 83.36,26.08 84.98,24.46 84.98,23.77 JP15.1
N$54
  Top 0.3: IC9.16 74.23,27.98 75.94,26.27 75.94,22.83 76.75,22.02 81.73,22.02 82.97,23.26 82.97,26.83 83.39,27.25 JP15.2
N$55
  Top 0.2: R31.2 73.6,36.35 72.84,35.59 IC9.10
N$56
  Top 0.2: IC9.8 78.3,36.87 78.41,36.98 C23.1
N$57
  Top 0.2: C23.2 80.58,39.22 84.76,43.4 J2.1
N$58
  Top 0.2: R33.1 81.65,35.52 82.27,36.14 C22.1
N$59
  Top 1.5: F2.P$1 82.12,13.4 81.52,14 J4.1
N$60
  Top 0.2: R54.2 69.9,63.11 70.02,63.23 77.53,63.23 79.25,64.95 JP21.1
N$61
  Top 0.2: R4.1 43.89,57.43 44.51,56.81 IC1.D
N$62
  Top 0.3: IC5.4 52.63,26.12 C18.2
N$63
  Top 0.2: R4.2 41.03,58.21 40.28,58.96 VR1.2
N$64
  Top 0.2: R13.2 27.09,61.17 R15.1
N$65
  Top 0.2: R31.1 75.12,39.79 C20.1
N$66
  Top 0.2: Q16.8 21.29,51.45 22.01,50.73 22.01,48.33 21.82,48.14 21.81,48.13 Q17.COLLECTOR
N$67
  Top 0.2: Q16.4 27.15,62.7 R15.2
  Bottom 0.8: Q16.5 Q16.4
N$68  (via drill 0.3)
  Top 0.2: 47.95,42.8 IC12.25 47.79,42.96 C60.2 46.52,43.87 C59.1 46.21,43.85 45.65,43.29 IC15.G 44.86,42.84 44.57,42.55 44.57,42.17 R57.2 v45.6,42.01 | v44.9,47.88 44.9,49.41 45.22,49.73 VR4.1
  Bottom 0.2: v45.6,42.01 45.6,42.56 45.72,42.68 45.72,43.22 46.51,44.01 46.51,47.56 46.07,48 45.02,48 v44.9,47.88
N$69
  Top 0.2: 78.85,34.08 C30.1 | 80.42,34.07 L6.2
  Top 0.3: L6.2 80.3,34.19 C30.1 78.73,34.33 IC9.6
N$70  (via drill 0.3)
  Top 0.2: R13.1 R14.1 29.12,58.19 29.33,58.4 IC2.4 29.97,58.46 v29.97,59.31 | Q10.1 37.19,55.22 v37.2,55.2
  Bottom 0.2: v29.97,59.31 29.97,56.12 32.06,54.03 36.66,54.03 37.2,54.57 v37.2,55.2
N$71
  Top 0.2: IC13.4 R50.1 VR2.1
N$72
  Top 0.2: R16.2
  Top 0.4: R16.2 26.29,55.16 25.68,55.77 25.68,57.9 25.28,58.3 Q16.2
  Bottom 0.8: Q16.7 Q16.2
N$73
  Top 0.3: Q7.4 Q7.5
N$74
  Top 0.3: Q7.2 15.13,23.59 15.79,24.25 21.05,24.25 C1.1 22.04,24.18 L2.2 22.44,26.07 C3.1 24.77,28.44 C4.2
N$75
  Top 0.2: Q9.8 28.11,25.73 29.52,24.32 29.52,22.01 29.79,21.74 31.98,21.74 32.27,22.03 Q12.COLLECTOR
N$76
  Top 0.2: Q8.COLLECTOR 18.28,29.09 17.99,28.8 17.99,26.27 Q7.8
N$77
  Top 0.3: Q1.2 10.57,20.52 Q1.6 Q7.3
N$78
  Top 0.2: C1.2 Q9.4
N$79
  Bottom 0.3: Q7.6 19.53,20.53 20.3,21.3 20.3,27.76 21.16,28.62 L2.1
N$80
  Top 0.2: Q1.8 12.23,26.58 12.23,28.84 11.88,29.19 Q4.COLLECTOR
N$81
  Top 0.2: 79,21.01 Q18.D 78.74,21.27 R30.2
N$82
  Top 0.3: Q1.5 11.57,17 13.41,15.16 L1.1
N$83
  Top 0.3: Q1.3 6.39,20.52 4.65,22.26 JP1.1
N$84  (via drill 0.3)
  Top 0.2: v69.76,53.02 69.74,53.04 IC13.1 68.56,52.1 67.54,51.08 67.54,47.37 67.26,47.09 R50.2 | D9.D 69.44,58.85 69.44,59.63 69.74,59.93 v69.76,59.93 69.9,60.07 R54.1
  Bottom 0.2: v69.76,53.02 v69.76,59.93
N$85
  Top 0.2: VR2.2 59.83,49.78 R47.2
N$86
  Top 0.8: Q5.3 58.93,14.56 58.5,14.13 JP2.2
  Bottom 0.8: Q5.6 Q5.3
N$87
  Top 0.2: Q20.1 C55.2 | IC12.5 58.08,39.25 58.28,39.05 60.88,39.05 C55.2 | 60.89,39.04 C55.2
N$88
  Top 0.8: Q5.2 56.73,15.52 55.01,13.8 JP2.1
  Bottom 0.8: Q5.7 Q5.2
N$89
  Top 0.8: Q5.4 61.13,15.31 62,14.44 JP2.3
  Bottom 0.8: Q5.5 Q5.4
N$90
  Top 0.2: JP22.1 67.75,64.72 66.55,63.52 R55.2
N$91  (via drill 0.3)
  Top 0.2: IC12.31 46.13,39.75 44.6,38.22 43.71,38.22 42.63,39.3 JP18.3 | R43.2 37.99,42.21 v37.64,42.01
  Bottom 0.2: v37.64,42.01 40.31,42.01 41.57,40.75 41.57,39.37 JP18.3
N$92
  Top 0.2: D8.S 59.71,33.31 60.17,32.85 60.17,32.3 R53.2 61.13,32.19 62.16,31.16 62.16,28.1 61.68,27.62 BAT1.+
N$93
  Top 0.2: Q15.2 47.21,52.82 47.55,53.16 48.38,53.16 48.84,53.62 JP10.2
N$94
  Top 0.2: JP10.3 50.11,52.98 50.38,52.71 Q14.2
N$95
  Top 0.2: IC12.3 59.26,38.25 59.58,37.93 59.58,37.59 60.73,36.44 60.73,33.94 61.19,33.48 Q19.1 62.43,33.12 62.88,33.12 63.31,32.69 C47.2
N$96
  Top 0.2: C48.2 63.59,37.55 62.95,36.91 62.3,36.91 Q19.4 61.1,36.69 60.01,37.78 60.01,38.32 59.68,38.65 58.1,38.65 58,38.75 IC12.4
N$97
  Top 0.2: JP10.4 51.38,53.41 51.96,52.83 53.29,52.83 53.64,52.48 Q13.2
PWM1  (via drill 0.3)
  Top 0.2: Q11.BASE 66.9,21.29 v62.47,25.72 | v51.76,34.42 IC12.41
  Bottom 0.2: v62.47,25.72 62.47,29.52 58.62,33.37 58.62,35 57.99,35.63 52.97,35.63 v51.76,34.42
RANGE  (via drill 0.3)
  Top 0.2: v20.67,50.62 20.67,49.66 Q17.BASE | IC12.29 33.66,40.75 32.12,42.29 26.02,42.29 v25.54,42.77
  Bottom 0.2: v20.67,50.62 20.67,47.64 v25.54,42.77
RELAY1
  Top 0.2: Q6.BASE 55.54,26.45 54.95,26.45 54.83,26.57 54.83,26.94 54.54,27.23 53.78,27.23 52.99,28.02 52.99,32.35 52.84,32.5 52.84,34.84 52.75,34.93 IC12.43
RIGHT
  Top 0.2: J2.3 76.23,43.4 75.14,42.31 C20.2
RXD_LA
  Top 0.2: IC4.9 | IC4.9 15.35,40.21 15.58,39.98 Q2.D | IC4.9 14.68,39.24 14.54,39.1 R2.1
RXI2  (via drill 0.3)
  Top 0.2: IC4.12 13.25,42.16 v13.1,42.34 | v51.23,37.81 51.23,35.52 IC12.40
  Bottom 0.2: v13.1,42.34 13.23,42.18 15.32,42.18 15.6,41.9 18.65,41.9 21.77,38.78 30.12,38.78 31.22,37.68 44.65,37.68 45.57,38.6 46.58,38.6 46.79,38.39 49.78,38.39 50.04,38.65 50.6,38.65 51.23,38.02 v51.23,37.81
SCL  (via drill 0.3)
  Top 0.2: IC12.30 45.11,40.25 JP18.4 | R44.2 41.33,42.22 v41.62,41.93
  Bottom 0.2: JP18.4 44.15,39.33 44.15,39.94 43.51,40.58 42.32,40.58 41.62,41.28 v41.62,41.93
SWCLK  (via drill 0.3)
  Top 0.2: v49.76,37.26 IC12.37 | 27.95,38.63 R45.1 | R45.1 27.95,39.2 27.68,39.47 25.74,39.47 25.18,40.03 JP19.4 | v46.08,37.53 46.05,37.57 45.67,37.57 45.21,37.11 29.53,37.11 28.7,37.94 28.7,38.47 28.65,38.52 R45.1
  Bottom 0.2: v49.76,37.26 49.73,37.26 49.69,37.3 46.31,37.3 v46.08,37.53
SWDIO
  Top 0.2: R46.1 29.53,38.64 29.53,37.92 29.94,37.51 45.04,37.51 45.78,38.25 IC12.34 | 29.54,38.65 R46.1 | JP19.2 29.18,39.69 29.54,39.33 29.54,38.53 R46.1
TC1_ADC  (via drill 0.3)
  Top 0.2: R39.2 54.39,56.7 54.71,56.38 C36.1 56.03,56.38 56.18,56.23 56.18,55.06 56.37,54.87 R34.2 56.99,54.86 v56.99,53.69 | IC12.18 52.75,45.28 53.69,46.22 53.69,49.4 54.72,50.43 v55.08,50.43
  Bottom 0.2: v55.08,50.43 55.8,50.43 56.75,51.38 56.75,53.45 v56.99,53.69
TXD_LA  (via drill 0.3)
  Top 0.2: R3.1 16.97,43.26 17.44,43.73 Q3.D 17.9,43.49 17.9,42.7 v17.77,42.57 | IC4.10 13.82,40.87 v13.42,40.52
  Bottom 0.2: v13.42,40.52 13.34,40.58 12.42,41.5 12.42,42.66 12.78,43.02 13.37,43.02 13.79,42.6 15.48,42.6 15.78,42.3 17.5,42.3 v17.77,42.57 17.73,42.57
TXO2  (via drill 0.3)
  Top 0.2: IC12.39 50.75,37.24 50.32,37.67 v50.32,37.98 | IC4.11 13.48,41.52 v13.43,41.46
  Bottom 0.2: v50.32,37.98 46.63,37.98 46.42,38.19 45.74,38.19 44.82,37.27 31.06,37.27 29.95,38.38 21.59,38.38 18.47,41.5 15.43,41.5 15.15,41.78 13.75,41.78 v13.43,41.46
UART_RXI
  Top 0.2: R5.1 19.71,40.69 19.48,40.92 Q2.S 18.54,41.56 19.24,42.26 19.24,44.35 18.62,44.97 18.62,63.57 19.53,64.48 21.42,64.48 22,65.06 JP4.5
UART_TXO
  Top 0.2: R6.1 21.34,44.46 21.12,44.68 Q3.S 19.53,44.68 19.03,45.18 19.03,63.41 19.69,64.07 23.5,64.07 24,64.57 JP4.7
USB_DM  (via drill 0.3)
  Top 0.2: v69.99,23.24 69.99,21.92 R26.1 | 53.24,39.44 v53.34,39.34 53.04,39.64 49.63,39.64 49.24,39.25 IC12.32
  Bottom 0.2: v53.34,39.34 53.57,39.11 55.66,39.11 59.45,35.32 59.45,33.69 63.81,29.33 67.76,29.33 69.99,27.1 v69.99,23.24
USB_DP  (via drill 0.3)
  Top 0.2: R27.1 69.94,20.43 v68.78,20.43 | IC12.33 49.41,38.75 49.87,39.21 52.05,39.21 v52.48,38.78 52.42,38.84
  Bottom 0.2: v52.48,38.78 52.69,38.57 55.62,38.57 59.04,35.15 59.04,33.53 63.64,28.93 67.59,28.93 67.59,28.91 69.5,27 69.5,23.89 69.08,23.47 69.08,20.73 v68.78,20.43
USB_EN  (via drill 0.3)
  Top 0.2: 76.66,17.78 R22.1 76.72,18.14 76.72,19.58 | 78.01,18.85 Q18.G 77.7,19.16 77.51,19.16 77.09,19.58 R23.2 76.72,19.58 | IC12.2 58.53,37.75 v58.69,37.59 | v74.41,21.5 74.41,21.12 74.98,20.55 76.38,20.55 76.72,20.21 76.72,19.58
  Bottom 0.2: v74.41,21.5 74.76,21.84 74.76,25.52 69.83,30.45 63.99,30.45 60.88,33.56 60.88,36.15 59.44,37.59 v58.69,37.59
VDD
  Top 0.2: Q2.G 20.11,39.02 R5.2 21.22,39.16 21.91,39.85 R6.2 | Q3.G 21.17,42.78 21.33,42.94 R6.2 | JP4.10 26.86,68 27.03,67.83 27.03,65 25.7,63.67 19.86,63.67 19.43,63.24 19.43,45.71 19.65,45.49 22.5,45.49 22.86,45.13 22.86,43.31 22.49,42.94 R6.2
VEE
  Top 0.2: R17.1 18.89,9.39 18.89,11.66 18.41,12.14 16.81,12.14 F1.P$2
  Top 0.8: JP8.1 4.19,14.25 5.48,15.54 8.8,15.54 10.83,13.51 10.83,12.51 11.44,11.9 J1.3 14.01,12.58 F1.P$2
VPP  (via drill 0.4, 0.6)
  Top 0.2: R19.2 28.32,7.94 28.78,7.48
  Top 0.3: IC8.2 IC8.1 31.13,51.43 30.91,51.65 C24.2 30.91,52.92 31.16,53.17 v31.16,53.44 v31.17,53.45 | IC10.1 38,52.72 | 38,52.72 C43.1 | 38,52.72 38,53.63 v38.01,53.8
  Top 0.5: IC8.2 28.82,47.91 23.02,42.11 23.02,37.01 22.4,36.39 22.4,31.3 v22.74,30.9 | v28.51,16.28 28.54,16.28 28.75,16.07 28.75,13.02 IC6.EX_PAD
  Top 1.27: IC6.EX_PAD 28.78,7.48 28.78,4.5 C14.1 27.21,4.41 26.34,3.54 D3.C
  Bottom 0.3: v31.17,53.45 31.83,53.45 31.96,53.58 37.79,53.58 v38.01,53.8
  Bottom 0.5: v22.74,30.9 22.83,30.84 22.89,30.81 25.43,30.81 26.67,29.57 26.67,18.12 v28.51,16.28

## Text on the board
_tplace: LATTEPANDA | MEASUREMENT | - | - | - | - | - | SHIELD V1.0 | + | + | + | + | + | RESET | CLK | +3.3V | i2C | SWD | +3.3V | GND | SDA | SCL | + | - | - | + | + | - | + | - | DC12V~24V IN
_bplace: L-CUR | L-V | H-V | H-CUR | ADC2 | ADC1 | TC-K | DAC1 | DAC2 | 4-WIRE KELVIN | TXO | STM32 | AUDIO-IN | RXI | RS232C | TXO | INTEL | RXI | SPEAKER | LEFT | CAN-L | CAN-BUS | CAN-H | RIGHT | LC-MEATER | DC-IN | GND | +5V